# EAGLE schematic esquema_vortex_001 (EAGLE 7.2.0)

## Sheet 1 of 7: CPU
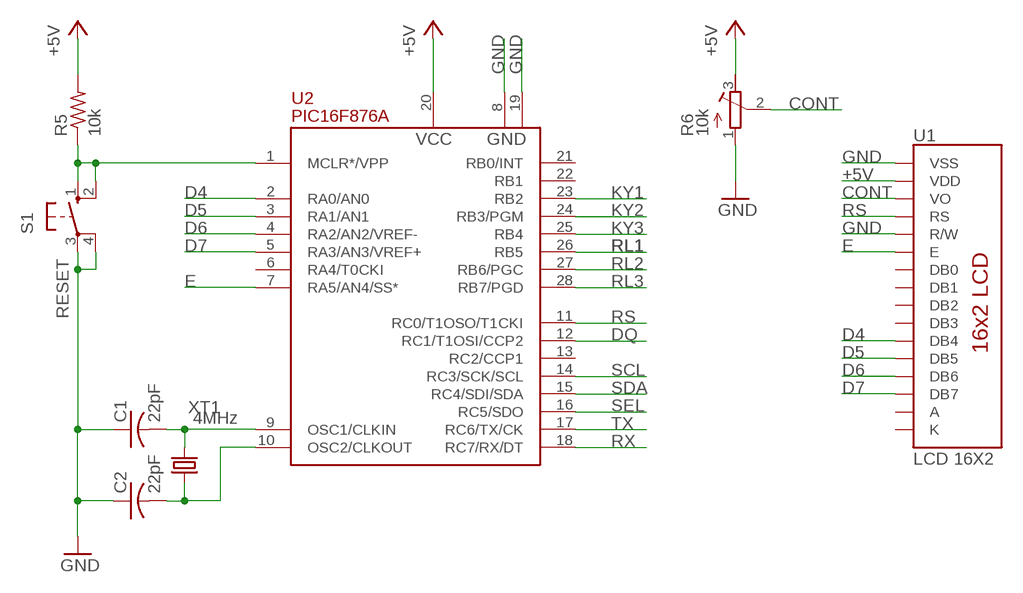
[diagram p0: schematic, sheet 1]

### Parts
C1  22pF  C-US025-030X050  [C025-030X050]
C2  22pF  C-US025-030X050  [C025-030X050]
R5  10k  R-US_0204/7  [0204/7]
R6  10k  R-TRIMM3296W  [RTRIM3296W]
S1  RESET  10-XX  [B3F-10XX]
U1  LCD 16X2  LCD-16X2SILK  [LCD-16X2]
U2  PIC16F876A  16F876SP  [DIL28-3]
XT1  4MHz  CRYSTALHC49S  [HC49/S]

### Nets
+5V: R5.2 R6.3(E) U1.2(VDD) U2.20(VCC) ; also sheet 2,3,4,6,7
CONT: R6.2(S) U1.3(VO)
D4: U1.11(DB4) U2.2(RA0/AN0)
D5: U1.12(DB5) U2.3(RA1/AN1)
D6: U1.13(DB6) U2.4(RA2/AN2/VREF-)
D7: U1.14(DB7) U2.5(RA3/AN3/VREF+)
DQ: U2.12(RC1/T1OSI/CCP2) ; also sheet 6
E: U1.6(E) U2.7(RA5/AN4/SS*)
GND: C1.1 C2.1 R6.1(A) S1.3(P) S1.4(P1) U1.1(VSS) U1.5(R/W) U2.8(GND) U2.19(GND) ; also sheet 2,3,4,5,6,7
KY1: U2.23(RB2) ; also sheet 7
KY2: U2.24(RB3/PGM) ; also sheet 7
KY3: U2.25(RB4) ; also sheet 7
N$6: C1.2 U2.9(OSC1/CLKIN) XT1.2
N$7: C2.2 U2.10(OSC2/CLKOUT) XT1.1
N$8: R5.1 S1.1(S) S1.2(S1) U2.1(MCLR*/VPP)
RL1: U2.26(RB5) ; also sheet 5
RL2: U2.27(RB6/PGC) ; also sheet 5
RL3: U2.28(RB7/PGD) ; also sheet 5
RS: U1.4(RS) U2.11(RC0/T1OSO/T1CKI)
RX: U2.18(RC7/RX/DT) ; also sheet 3
SCL: U2.14(RC3/SCK/SCL) ; also sheet 4
SDA: U2.15(RC4/SDI/SDA) ; also sheet 4
SEL: U2.16(RC5/SDO) ; also sheet 3
TX: U2.17(RC6/TX/CK) ; also sheet 3
Unconnected: U1.7(DB0) U1.8(DB1) U1.9(DB2) U1.10(DB3) U2.6(RA4/T0CKI) U2.13(RC2/CCP1) U2.21(RB0/INT) U2.22(RB1)

## Sheet 2 of 7: POWER
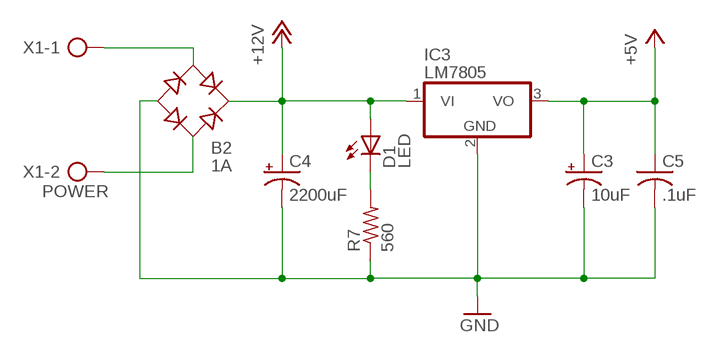
[diagram p1: schematic, sheet 2]

### Parts
B2  1A  RB1A  [RB1A]
C3  10uF  CPOL-USE2.5-7  [E2,5-7]
C4  2200uF  CPOL-USE3.5-10  [E3,5-10]
C5  .1uF  C-US050-024X044  [C050-024X044]
D1  LED  LED3MM  [LED3MM]
IC3  LM7805  7812TV  [TO220V]
R7  560  R-US_0204/7  [0204/7]
X1  POWER  AK500/2  [AK500/2]

### Nets
+5V: C3.+ C5.1 IC3.3(VO) ; also sheet 1,3,4,6,7
+12V: B2.+ C4.+ D1.A IC3.1(VI) ; also sheet 5
GND: B2.- C3.- C4.- C5.2 IC3.2(GND) R7.1 ; also sheet 1,3,4,5,6,7
N$5: B2.AC1 X1.1
N$9: B2.AC2 X1.2
N$12: D1.K(C) R7.2

## Sheet 3 of 7: RS485
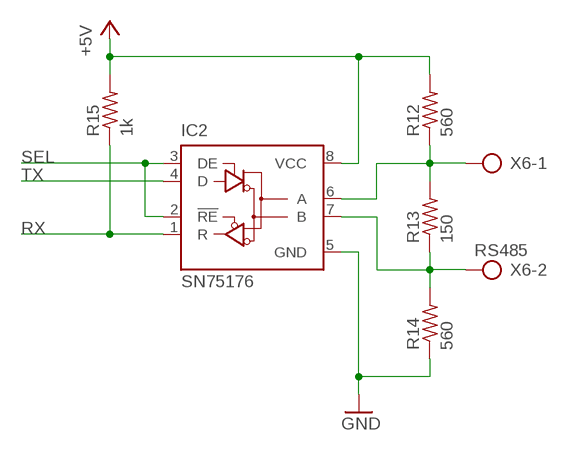
[diagram p2: schematic, sheet 3]

### Parts
IC2  SN75176  75176AP  [DIL08]
R12  560  R-US_0204/7  [0204/7]
R13  150  R-US_0204/7  [0204/7]
R14  560  R-US_0204/7  [0204/7]
R15  1k  R-US_0204/7  [0204/7]
X6  RS485  AK500/2-H  [AK500/2-H]

### Nets
+5V: IC2.8(VCC) R12.2 R15.2 ; also sheet 1,2,4,6,7
GND: IC2.5(GND) R14.1 ; also sheet 1,2,4,5,6,7
N$13: IC2.7(B) R13.1 R14.2 X6.2
N$15: IC2.6(A) R12.1 R13.2 X6.1
RX: IC2.1(R) R15.1 ; also sheet 1
SEL: IC2.2(!RE) IC2.3(DE) ; also sheet 1
TX: IC2.4(D) ; also sheet 1

## Sheet 4 of 7: RTC
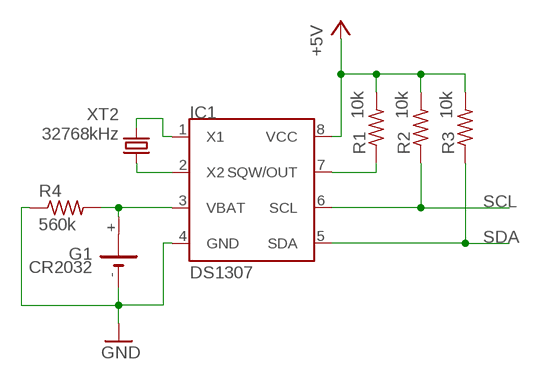
[diagram p3: schematic, sheet 4]

### Parts
G1  CR2032  CR2032H  [CR2032H]
IC1  DS1307  DS1307PDIP  [DIL08]
R1  10k  R-US_0204/7  [0204/7]
R2  10k  R-US_0204/7  [0204/7]
R3  10k  R-US_0204/7  [0204/7]
R4  560k  R-US_0204/7  [0204/7]
XT2  32768kHz  CRYSTALHC49S  [HC49/S]

### Nets
+5V: IC1.8(VCC) R1.2 R2.2 R3.2 ; also sheet 1,2,3,6,7
GND: G1.- IC1.4(GND) R4.1 ; also sheet 1,2,3,5,6,7
N$1: IC1.2(X2) XT2.1
N$2: IC1.1(X1) XT2.2
N$3: G1.+ IC1.3(VBAT) R4.2
N$4: IC1.7(SQW/OUT) R1.1
SCL: IC1.6(SCL) R2.1 ; also sheet 1
SDA: IC1.5(SDA) R3.1 ; also sheet 1
Unconnected: G1.+@1(+)

## Sheet 5 of 7: RELE
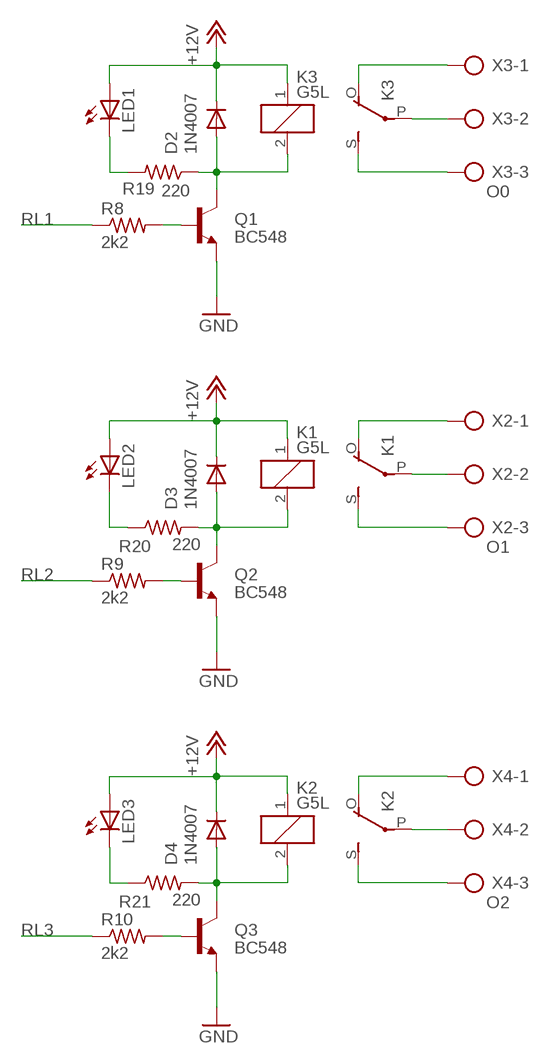
[diagram p4: schematic, sheet 5]

### Parts
D2  1N4007  1N4004  [DO41-10]
D3  1N4007  1N4004  [DO41-10]
D4  1N4007  1N4004  [DO41-10]
K1  G5L  [G5LE]
K2  G5L  [G5LE]
K3  G5L  [G5LE]
LED1  LED  LED3MM  [LED3MM]
LED2  LED  LED3MM  [LED3MM]
LED3  LED  LED3MM  [LED3MM]
Q1  BC548  [TO92-EBC]
Q2  BC548  [TO92-EBC]
Q3  BC548  [TO92-EBC]
R8  2k2  R-US_0204/7  [0204/7]
R9  2k2  R-US_0204/7  [0204/7]
R10  2k2  R-US_0204/7  [0204/7]
R19  220  R-US_0204/7  [0204/7]
R20  220  R-US_0204/7  [0204/7]
R21  220  R-US_0204/7  [0204/7]
X2  O1  AK500/3  [AK500/3]
X3  O0  AK500/3  [AK500/3]
X4  O2  AK500/3  [AK500/3]

### Nets
+12V: D2.C D3.C D4.C K1.1 K2.1 K3.1 LED1.A LED2.A LED3.A ; also sheet 2
GND: Q1.E Q2.E Q3.E ; also sheet 1,2,3,4,6,7
N$10: LED1.K(C) R19.2
N$11: Q1.B R8.2
N$14: D2.A K3.2 Q1.C R19.1
N$16: K3.S(2:S) X3.3
N$17: K3.P(2:P) X3.2
N$18: K3.O(2:O) X3.1
N$19: Q2.B R9.2
N$20: D3.A K1.2 Q2.C R20.2
N$21: K1.S(2:S) X2.3
N$22: K1.P(2:P) X2.2
N$23: K1.O(2:O) X2.1
N$24: Q3.B R10.2
N$25: D4.A K2.2 Q3.C R21.2
N$26: K2.S(2:S) X4.3
N$27: K2.P(2:P) X4.2
N$28: K2.O(2:O) X4.1
N$29: LED2.K(C) R20.1
N$32: LED3.K(C) R21.1
RL1: R8.1 ; also sheet 1
RL2: R9.1 ; also sheet 1
RL3: R10.1 ; also sheet 1

## Sheet 6 of 7: SENSOR
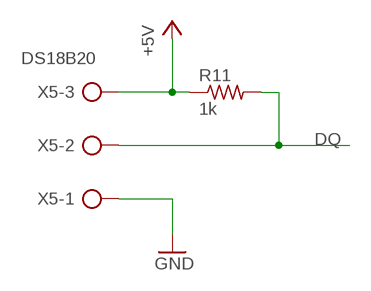
[diagram p5: schematic, sheet 6]

### Parts
R11  1k  R-US_0204/7  [0204/7]
X5  DS18B20  AK500/3-H  [AK500/3-H]

### Nets
+5V: R11.1 X5.3 ; also sheet 1,2,3,4,7
DQ: R11.2 X5.2 ; also sheet 1
GND: X5.1 ; also sheet 1,2,3,4,5,7

## Sheet 7 of 7: TECLADO
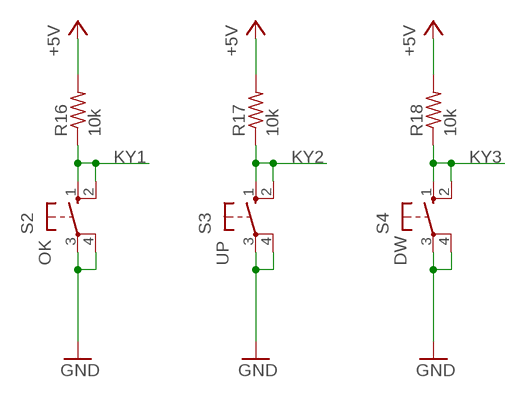
[diagram p6: schematic, sheet 7]

### Parts
R16  10k  R-US_0204/7  [0204/7]
R17  10k  R-US_0204/7  [0204/7]
R18  10k  R-US_0204/7  [0204/7]
S2  OK  10-XX  [B3F-10XX]
S3  UP  10-XX  [B3F-10XX]
S4  DW  10-XX  [B3F-10XX]

### Nets
+5V: R16.2 R17.2 R18.2 ; also sheet 1,2,3,4,6
GND: S2.3(P) S2.4(P1) S3.3(P) S3.4(P1) S4.3(P) S4.4(P1) ; also sheet 1,2,3,4,5,6
KY1: R16.1 S2.1(S) S2.2(S1) ; also sheet 1
KY2: R17.1 S3.1(S) S3.2(S1) ; also sheet 1
KY3: R18.1 S4.1(S) S4.2(S1) ; also sheet 1

## Power pins joined to a net without a drawn wire
A: U1.15(A)
K: U1.16(K)

## Library data of the parts
B2 = rectifier:RB1A: RECTIFIER 1 A
C1 C2 C5 = adafruit:C-US: CAPACITOR, American symbol
C3 C4 = adafruit:CPOL-US: POLARIZED CAPACITOR, American symbol
D1 = adafruit:LED: LED
D2-D4 = adafruit:1N4004: DIODE General purpose 1N400x type rectifier (With bigger pads) http://www.ladyada.net/library/pcb/eaglelibrary.html
G1 = battery:CR2032H: LI BATTERY Varta
IC1 = -redpic-ic-components:DS1307: I2C Serial RTC w/56 bytes battery backed RAM
IC2 = 751xx:75176A: DIFFERENTIAL BUS TRANSCEIVER Source: http://focus.ti.com/lit/ds/symlink/sn75176a.pdf
IC3 = linear:78*: Positive VOLTAGE REGULATOR Source: http://cache.national.com/ds/LM/LM78L05.pdf http://www.fairchildsemi.com/ds/LM/LM7805.pdf
K1-K3 = relay:G5L: RELAY 1 x switch, 10 A/120 V AC, 8 A/30 V ADC, Omron; OC_FARNELL: unknown; OC_NEWARK: unknown
LED1-LED3 = led:LED: LED
Q1-Q3 = transistor-npn:BC548*: NPN Transistor
R1-R4 R8-R15 R19-R21 = adafruit:R-US_: RESISTOR, American symbol
R5 R7 R16-R18 = rcl:R-US_: RESISTOR, American symbol
R6 = rcl:R-TRIMM: Trimm resistor
S1-S4 = switch-omron:10-XX: OMRON SWITCH; MPN: B3F-1000; OC_FARNELL: 176432; OC_NEWARK: 36M3542
U1 = SparkFun-Displays:LCD-16X2: Standard text-only 16x2 parallel input LCD
U2 = -redpic-microchip-pic:16F876: Microchip PIC 16F876
X1 = con-ptr500:AK500/2: CONNECTOR; OC_FARNELL: unknown; OC_NEWARK: unknown
X2-X4 = con-ptr500:AK500/3: CONNECTOR; OC_FARNELL: unknown; OC_NEWARK: unknown
X5 = con-ptr500:AK500/3-H: CONNECTOR Aug. 2004 / PTR Meßtechnik: Die Bezeichnung der Serie AK505 wurde geändert. Es handelt sich hierbei um AK500 in horizontaler Ausführung.; OC_FARNELL: unknown; OC_NEWARK: unknown
X6 = con-ptr500:AK500/2-H: CONNECTOR Aug. 2004 / PTR Meßtechnik: Die Bezeichnung der Serie AK505 wurde geändert. Es handelt sich hierbei um AK500 in horizontaler Ausführung.; OC_FARNELL: unknown; OC_NEWARK: unknown
XT1 XT2 = crystal:CRYSTAL: CRYSTAL; OC_FARNELL: 1667008; OC_NEWARK: unknown